# Altium project class-sensor.PrjPcb (part 2 of 2)

## Sheet sensor-4.SchDoc
size Letter
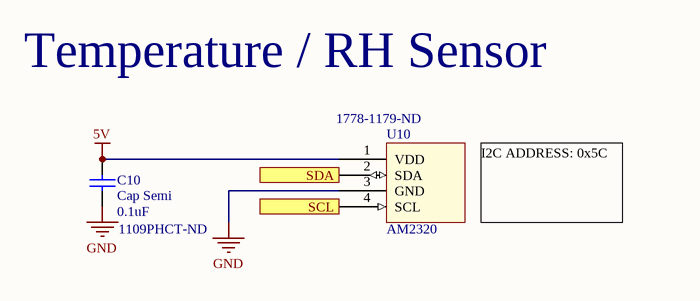
[diagram p3: sensor-4.SchDoc]

### Parts
C10  Cap Semi  value 0.1uF  Supplier Part Number 1: 1109PHCT-ND  [A104K15X7RF5TAA]
U10  AM2320  Supplier Part Number 1: 1778-1179-ND  [AM2320]

### Ports
SCL, SDA

### Nets
5V: C10.2 U10.1(VDD)
GND: C10.1 U10.3(GND)
NetR3_1: U10.4(SCL) ; port SCL
NetR4_1: U10.2(SDA) ; port SDA

### Notes on the sheet
- Temperature / RH Sensor
- I2C ADDRESS: 0x5C

### Library data of the parts
C10 = Cap Semi: Capacitor (Semiconductor SIM Model); Manufacturer: Vishay BCcomponents; Capacitance: 100nF; Voltage Rating: 50V; Tolerance: 10%; Dielectric: X7R; Lead Length: 24.3mm; Lead Diameter: 0.5mm; Published: 8-Jun-2000; LatestRevisionDate: 29-May-2009; LatestRevisionNote: IPC-7351 Footprint Added.; PackageReference: C1206; Publisher: Altium Limited; PackageDescription: Chip Capacitor; Supplier 1: Digi-Key; Manufacturer Part Number: A104K15X7RF5TAA; Stock 1: 502711; Pricing 1: 1=0.24000, 10=0.16500, 100=0.09350, 500=0.06598, 1000=0.05773, 2500=0.05498 (USD); RoHS: Yes; Mount: Through Hole,PCB,Axial; Case/Package: Dipped; Contact Plating: Tin; Min Operating Temperature: -55°C; Max Operating Temperature: 125°C; Package Quantity: 1; Packaging: Tape and Reel; Voltage Rating (DC): 50V; Termination: Axial; Voltage: 50V; Diameter: 2.5mm; Length: 3.8mm; Radiation Hardening: No; REACH SVHC: Unknown; Lead Free: Lead Free; ComponentLink1URL: https://datasheet.ciiva.com/145/aseries-145936.pdf?src-supplier=Digi-Key; ComponentLink1Description: https://datasheet.ciiva.com/145/aseries-145936.pdf?src-supplier=Digi-Key; ComponentLink2URL: https://datasheet.ciiva.com/5815/1734588-5815375.pdf?src-supplier=Farnell; ComponentLink2Description: https://datasheet.ciiva.com/5815/1734588-5815375.pdf?src-supplier=Farnell; ComponentLink3URL: https://datasheet.ciiva.com/18442/70122957-18442089.pdf?src-supplier=Allied+Electronics; ComponentLink3Description: https://datasheet.ciiva.com/18442/70122957-18442089.pdf?src-supplier=Allied+Electronics; ComponentLink4URL: https://datasheet.ciiva.com/2988/aseries-2988250.pdf?src-supplier=Avnet; ComponentLink4Description: https://datasheet.ciiva.com/2988/aseries-2988250.pdf?src-supplier=Avnet; ComponentLink5URL: https://datasheet.ciiva.com/17444/aseries-17444908.pdf?src-supplier=Avnet+Europe; ComponentLink5Description: https://datasheet.ciiva.com/17444/aseries-17444908.pdf?src-supplier=Avnet+Europe; ComponentLink6URL: https://datasheet.ciiva.com/46418/1796772-46418252.pdf?src-supplier=Element14; ComponentLink6Description: https://datasheet.ciiva.com/46418/1796772-46418252.pdf?src-supplier=Element14; ComponentLink7URL: https://datasheet.ciiva.com/145/aseries-145935.pdf?src-supplier=Digi-Key; ComponentLink7Description: https://datasheet.ciiva.com/145/aseries-145935.pdf?src-supplier=Digi-Key
U10 = AM2320: Humidity Temperature Sensor 10 ~ 99% RH I²C ±3% RH 5s Through Hole; Manufacturer: Pimoroni; Manufacturer Part Number: COM1700; Supplier 1: Digi-Key; Stock 1: 149; Pricing 1: 1=3.76000 (USD); RoHS: No

## Sheet sensor-5.SchDoc
size Letter
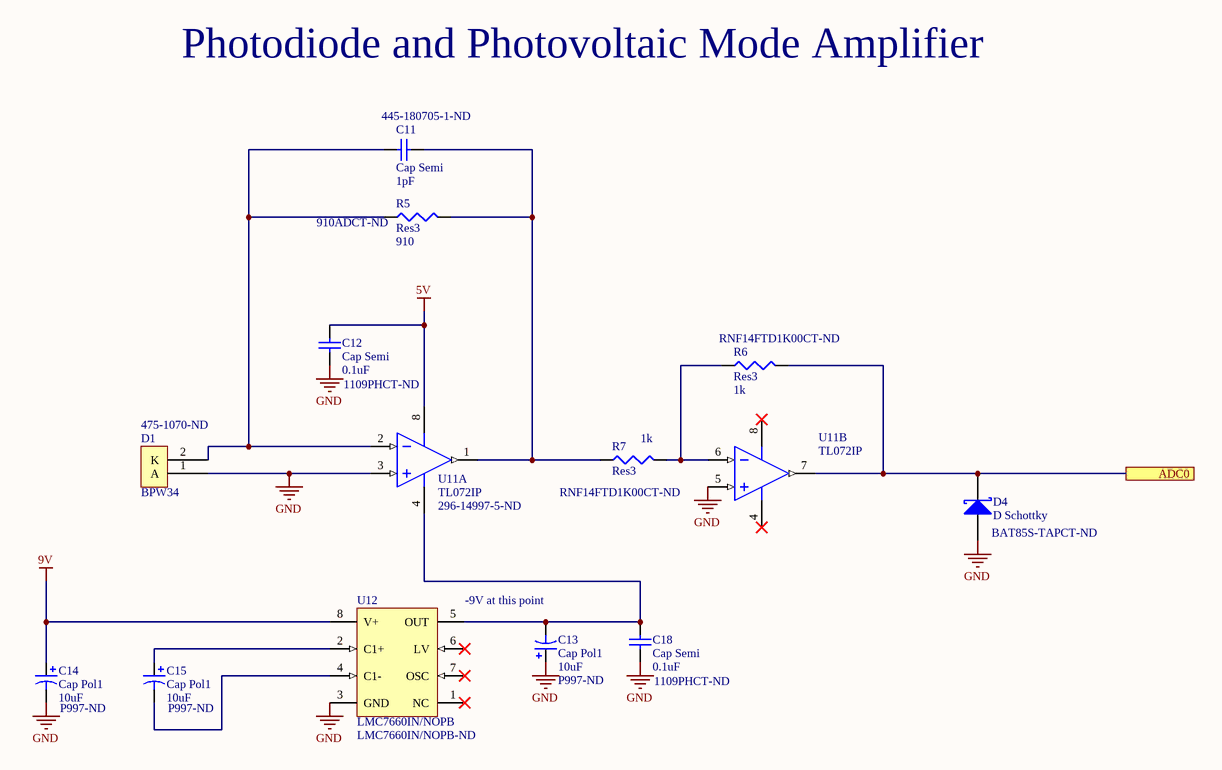
[diagram p4: sensor-5.SchDoc]

### Parts
C11  Cap Semi  value 1pF  Supplier Part Number 1: 445-180705-1-ND  [FA28C0G1H010CNU06]
C12  Cap Semi  value 0.1uF  Supplier Part Number 1: 1109PHCT-ND  [A104K15X7RF5TAA]
C13  Cap Pol1  value 10uF  Supplier Part Number 1: P997-ND  [ECE-A1HKS100]
C14  Cap Pol1  value 10uF  Supplier Part Number 1: P997-ND  [ECE-A1HKS100]
C15  Cap Pol1  value 10uF  Supplier Part Number 1: P997-ND  [ECE-A1HKS100]
C18  Cap Semi  value 0.1uF  Supplier Part Number 1: 1109PHCT-ND  [A104K15X7RF5TAA]
D1  BPW34  Supplier Part Number 1: 475-1070-ND  [BPW34]
D4  D Schottky  Supplier Part Number 1: BAT85S-TAPCT-ND  [BAT85S-TAP]
R5  Res3  value 910  Supplier Part Number 1: 910ADCT-ND  [MFP-25BRD52-910R]
R6  Res3  value 1k  Supplier Part Number 1: RNF14FTD1K00CT-ND  [RNF14FTD1K00]
R7  Res3  value 1k  Supplier Part Number 1: RNF14FTD1K00CT-ND  [RNF14FTD1K00]
U11  TL072IP  Supplier Part Number 1: 296-14997-5-ND  [P0008A]  (parts A,B of 2)
U12  LMC7660IN/NOPB  Supplier Part Number 1: LMC7660IN/NOPB-ND  [P0008A]

### Ports
ADC0

### Nets
5V: C12.2 U11.8(VCC+)
9V: C14.1 U12.8(V+)
GND: C12.1 C13.1 C14.2 C18.1 D1.1(A) D4.1(A) U11.3(IN1+) U11.5(IN2+) U12.3(GND)
NetC11_1: C11.1 D1.2(K) R5.1 U11.2(IN1-)
NetC11_2: C11.2 R5.2 R7.1 U11.1(OUT1)
NetC13_2: C13.2 C18.2 U11.4(VCC-) U12.5(OUT)
NetC15_1: C15.1 U12.2(C1+)
NetC15_2: C15.2 U12.4(C1-)
NetD4_2: D4.2(K) R6.2 U11.7(OUT2) ; port ADC0
NetR6_1: R6.1 R7.2 U11.6(IN2-)

Not connected (* = marked no-connect by the designer): U12 1(NC)* 6(LV)* 7(OSC)*

### Notes on the sheet
- Photodiode and Photovoltaic Mode Amplifier
- -9V at this point

### Library data of the parts
C11 = Cap Semi: Capacitor (Semiconductor SIM Model); Manufacturer: TDK; Voltage Rating: 50V; Lead/Base Style: Kinked; Published: 8-Jun-2000; LatestRevisionDate: 29-May-2009; LatestRevisionNote: IPC-7351 Footprint Added.; PackageReference: C1206; Publisher: Altium Limited; PackageDescription: Chip Capacitor; Supplier 1: Digi-Key; Manufacturer Part Number: FA28C0G1H010CNU06; Stock 1: 7819; Pricing 1: 1=0.32000, 10=0.22100, 100=0.12520, 500=0.08840, 1000=0.07735 (USD); Mount: Through Hole; Case/Package: Radial; Min Operating Temperature: -55°C; Max Operating Temperature: 125°C; Packaging: Tape and Reel; Capacitance: 1pF; Length: 0.157inch; Width: 0.098inch; Height - Seated (Max): 0.217inch; Lead Pitch: 0.197inch; Ratings: AEC-Q200; ComponentLink1URL: https://product.tdk.com/info/en/catalog/datasheets/leadmlcc_halogenfree_fa_en.pdf?src-supplier=Digi-Key; ComponentLink1Description: https://product.tdk.com/info/en/catalog/datasheets/leadmlcc_halogenfree_fa_en.pdf?src-supplier=Digi-Key
C12 C18 = Cap Semi: as C10 on sheet sensor-4; Published: 8-Jun-2000; LatestRevisionDate: 29-May-2009; LatestRevisionNote: IPC-7351 Footprint Added.; PackageReference: C1206; Publisher: Altium Limited; PackageDescription: Chip Capacitor; Supplier 1: Digi-Key; Manufacturer Part Number: A104K15X7RF5TAA; Stock 1: 502711; Pricing 1: 1=0.24000, 10=0.16500, 100=0.09350, 500=0.06598, 1000=0.05773, 2500=0.05498 (USD); RoHS: Yes; Mount: Through Hole,PCB,Axial; Case/Package: Dipped; Contact Plating: Tin; Min Operating Temperature: -55°C; Max Operating Temperature: 125°C; Package Quantity: 1; Packaging: Tape and Reel; Voltage Rating (DC): 50V; Termination: Axial; Voltage: 50V; Diameter: 2.5mm; Length: 3.8mm; Radiation Hardening: No; REACH SVHC: Unknown; Lead Free: Lead Free; ComponentLink1URL: https://datasheet.ciiva.com/145/aseries-145936.pdf?src-supplier=Digi-Key; ComponentLink1Description: https://datasheet.ciiva.com/145/aseries-145936.pdf?src-supplier=Digi-Key; ComponentLink2URL: https://datasheet.ciiva.com/5815/1734588-5815375.pdf?src-supplier=Farnell; ComponentLink2Description: https://datasheet.ciiva.com/5815/1734588-5815375.pdf?src-supplier=Farnell; ComponentLink3URL: https://datasheet.ciiva.com/18442/70122957-18442089.pdf?src-supplier=Allied+Electronics; ComponentLink3Description: https://datasheet.ciiva.com/18442/70122957-18442089.pdf?src-supplier=Allied+Electronics; ComponentLink4URL: https://datasheet.ciiva.com/2988/aseries-2988250.pdf?src-supplier=Avnet; ComponentLink4Description: https://datasheet.ciiva.com/2988/aseries-2988250.pdf?src-supplier=Avnet; ComponentLink5URL: https://datasheet.ciiva.com/17444/aseries-17444908.pdf?src-supplier=Avnet+Europe; ComponentLink5Description: https://datasheet.ciiva.com/17444/aseries-17444908.pdf?src-supplier=Avnet+Europe; ComponentLink6URL: https://datasheet.ciiva.com/46418/1796772-46418252.pdf?src-supplier=Element14; ComponentLink6Description: https://datasheet.ciiva.com/46418/1796772-46418252.pdf?src-supplier=Element14; ComponentLink7URL: https://datasheet.ciiva.com/145/aseries-145935.pdf?src-supplier=Digi-Key; ComponentLink7Description: https://datasheet.ciiva.com/145/aseries-145935.pdf?src-supplier=Digi-Key
C13-C15 = Cap Pol1: Polarized Capacitor (Radial); Manufacturer: Panasonic; Ripple Current: 35mA; Tolerance: 20%; Voltage Rating: 50V; Polarity: Polar; Life (Hours): 1000Hour; Leakage Current: 3A; Lead Diameter: 0.45mm; Published: 8-Jun-2000; LatestRevisionDate: 17-Jul-2002; LatestRevisionNote: Re-released for DXP Platform.; PackageReference: RB7.6-15; Publisher: Altium Limited; PackageDescription: Polarized Capacitor (Radial); 2 Leads; Supplier 1: Digi-Key; Manufacturer Part Number: ECE-A1HKS100; Stock 1: 132836; Pricing 1: 1=0.10000, 10=0.03000 (USD); RoHS: Yes; Mount: Through Hole,PCB; Case/Package: Radial; Number of Pins: 2; Weight: 0.01lb; Min Operating Temperature: -40°C; Max Operating Temperature: 85°C; Package Quantity: 200; Capacitance: 10uF; Packaging: Bulk; Voltage Rating (DC): 50V; Ripple Current (AC): 35mA; Termination: Radial; Voltage: 50V; Diameter: 6.3mm; Length: 5mm; Height: 5mm; Lead Pitch: 2.5mm; Width: 0.5inch; Height - Seated (Max): 0.197inch; Radiation Hardening: No; Lead Free: Lead Free; REACH SVHC: No SVHC; ComponentLink1URL: https://datasheet.ciiva.com/11778/0900766b800274c4-11778985.pdf?src-supplier=RSComponents; ComponentLink1Description: https://datasheet.ciiva.com/11778/0900766b800274c4-11778985.pdf?src-supplier=RSComponents; ComponentLink2URL: https://datasheet.ciiva.com/17536/aba0000ce15-17536597.pdf?src-supplier=Avnet+Europe; ComponentLink2Description: https://datasheet.ciiva.com/17536/aba0000ce15-17536597.pdf?src-supplier=Avnet+Europe; ComponentLink3URL: https://datasheet.ciiva.com/14594/70067878-14594328.pdf?src-supplier=Allied+Electronics; ComponentLink3Description: https://datasheet.ciiva.com/14594/70067878-14594328.pdf?src-supplier=Allied+Electronics; ComponentLink4URL: https://datasheet.ciiva.com/16205/aba0000ce15-16205737.pdf?src-supplier=Future+Electronics; ComponentLink4Description: https://datasheet.ciiva.com/16205/aba0000ce15-16205737.pdf?src-supplier=Future+Electronics; ComponentLink5URL: https://datasheet.ciiva.com/24025/a-e-461514-24025641.pdf?src-supplier=Mouser; ComponentLink5Description: https://datasheet.ciiva.com/24025/a-e-461514-24025641.pdf?src-supplier=Mouser; ComponentLink6URL: https://datasheet.ciiva.com/43459/1339471-43459545.pdf?src-supplier=Farnell; ComponentLink6Description: https://datasheet.ciiva.com/43459/1339471-43459545.pdf?src-supplier=Farnell; ComponentLink7URL: https://datasheet.ciiva.com/15166/getdatasheetpartid-169217-15166123.pdf?src-supplier=Verical; ComponentLink7Description: https://datasheet.ciiva.com/15166/getdatasheetpartid-169217-15166123.pdf?src-supplier=Verical; ComponentLink8URL: https://datasheet.ciiva.com/46397/1339471-46397117.pdf?src-supplier=Element14; ComponentLink8Description: https://datasheet.ciiva.com/46397/1339471-46397117.pdf?src-supplier=Element14; ComponentLink9URL: https://datasheet.ciiva.com/2983/aba0000ce15-2983886.pdf?src-supplier=Avnet; ComponentLink9Description: https://datasheet.ciiva.com/2983/aba0000ce15-2983886.pdf?src-supplier=Avnet
D1 = BPW34: Manufacturer: Osram Opto; Reverse Breakdown Voltage: 32V; Forward Voltage: 1.3V; Rise Time: 20ns; Wavelength: 850nm; Polarity: Reverse; Power Dissipation: 150mW; Dark Current: 30nA; Supplier 1: Digi-Key; Manufacturer Part Number: BPW34; Stock 1: 40998; Pricing 1: 1=1.05000, 10=0.81700, 100=0.52550, 500=0.44374, 1000=0.35033, 2500=0.32697, 5000=0.31529, 10000=0.31062, 25000=0.30362 (USD); RoHS: Yes; Mount: Through Hole; Number of Pins: 2; Min Operating Temperature: -40°C; Max Operating Temperature: 100°C; Packaging: Bulk; Fall Time: 20ns; Radiation Hardening: No; ComponentLink1URL: https://datasheet.ciiva.com/19453/1621132-19453495.pdf?src-supplier=Jameco; ComponentLink1Description: https://datasheet.ciiva.com/19453/1621132-19453495.pdf?src-supplier=Jameco; ComponentLink2URL: https://datasheet.ciiva.com/11772/0900766b80a15a67-11772491.pdf?src-supplier=RSComponents; ComponentLink2Description: https://datasheet.ciiva.com/11772/0900766b80a15a67-11772491.pdf?src-supplier=RSComponents; ComponentLink3URL: https://datasheet.ciiva.com/26883/getdatasheetpartid-571168-26883163.pdf?src-supplier=Verical; ComponentLink3Description: https://datasheet.ciiva.com/26883/getdatasheetpartid-571168-26883163.pdf?src-supplier=Verical; ComponentLink4URL: https://datasheet.ciiva.com/29138/153005-da-01-ml-pin-photodiode-bpw34-osr-de-en-29138768.pdf?src-supplier=Conrad; ComponentLink4Description: https://datasheet.ciiva.com/29138/153005-da-01-ml-pin-photodiode-bpw34-osr-de-en-29138768.pdf?src-supplier=Conrad
D4 = D Schottky: Schottky Diode; Manufacturer: Vishay; Forward Current: 200mA; Peak Reverse Current: 2uA; Reverse Recovery Time: 5ns; Peak Non-Repetitive Surge Current: 5A; Max Repetitive Reverse Voltage (Vrrm): 30V; Element Configuration: Single; Forward Voltage: 800mV; Published: 8-Jun-2000; LatestRevisionDate: 17-Jul-2002; LatestRevisionNote: Re-released for DXP Platform.; PackageReference: SMB; Publisher: Altium Limited; PackageDescription: DO-214-AA/SMB; 2 C-Bend Leads; Body 5.3 x 3.6 mm, inc. leads (LxW); Code_JEDEC: DO-214-AA; Supplier 1: Digi-Key; Manufacturer Part Number: BAT85S-TAP; Stock 1: 54447; Pricing 1: 1=0.38000, 10=0.31000, 100=0.16440, 500=0.10816, 1000=0.07354, 2500=0.06633, 5000=0.05768 (USD); RoHS: Yes; Mount: Through Hole; Number of Pins: 2; Contact Plating: Tin,Silver; Min Operating Temperature: -65°C; Max Operating Temperature: 125°C; Package Quantity: 10000; Packaging: Ammo Pack; Average Rectified Current: 200mA; Max Reverse Voltage (DC): 30V; Max Surge Current: 5A; Recovery Time: 5ns; Max Reverse Leakage Current: 2uA; Max Forward Surge Current (Ifsm): 5A; Length: 3.9mm; Height: 1.7mm; Width: 1.7mm; Radiation Hardening: No; Lead Free: Lead Free; ComponentLink1URL: https://datasheet.ciiva.com/23785/1749004-23785297.pdf?src-supplier=Newark; ComponentLink1Description: https://datasheet.ciiva.com/23785/1749004-23785297.pdf?src-supplier=Newark; ComponentLink2URL: https://datasheet.ciiva.com/17078/bat85s-tap-17078427.pdf?src-supplier=Allied+Electronics; ComponentLink2Description: https://datasheet.ciiva.com/17078/bat85s-tap-17078427.pdf?src-supplier=Allied+Electronics; ComponentLink3URL: https://datasheet.ciiva.com/15144/getdatasheetpartid-50689-15144221.pdf?src-supplier=Verical; ComponentLink3Description: https://datasheet.ciiva.com/15144/getdatasheetpartid-50689-15144221.pdf?src-supplier=Verical; ComponentLink4URL: https://datasheet.ciiva.com/16418/bat85s-16418454.pdf?src-supplier=Future+Electronics; ComponentLink4Description: https://datasheet.ciiva.com/16418/bat85s-16418454.pdf?src-supplier=Future+Electronics; ComponentLink5URL: https://datasheet.ciiva.com/25931/bat85s-25931304.pdf?src-supplier=Avnet+Europe; ComponentLink5Description: https://datasheet.ciiva.com/25931/bat85s-25931304.pdf?src-supplier=Avnet+Europe; ComponentLink6URL: https://datasheet.ciiva.com/13950/bat85s-13950093.pdf?src-supplier=Digi-Key; ComponentLink6Description: https://datasheet.ciiva.com/13950/bat85s-13950093.pdf?src-supplier=Digi-Key; ComponentLink7URL: https://datasheet.ciiva.com/13950/bat85s-13950090.pdf?src-supplier=Digi-Key; ComponentLink7Description: https://datasheet.ciiva.com/13950/bat85s-13950090.pdf?src-supplier=Digi-Key; ComponentLink8URL: https://datasheet.ciiva.com/8283/bat85s-8283915.pdf?src-supplier=Avnet; ComponentLink8Description: https://datasheet.ciiva.com/8283/bat85s-8283915.pdf?src-supplier=Avnet
R5 = Res3: Resistor; Manufacturer: Yageo; Resistance: 910R; Tolerance: 0.1%; Max Power Dissipation: 250mW; Temperature Coefficient: 25ppm/°C; Published: 8-Jun-2000; LatestRevisionDate: 29-May-2009; LatestRevisionNote: IPC-7351 Footprint Added.; PackageReference: J1-0603; Publisher: Altium Limited; PackageDescription: Chip Resistor; Supplier 1: Digi-Key; Manufacturer Part Number: MFP-25BRD52-910R; Stock 1: 18352; Pricing 1: 1=0.63000, 10=0.46700, 25=0.37920, 50=0.32960, 100=0.27190, 250=0.23624, 500=0.19228, 1000=0.15250 (USD); RoHS: Yes; Case/Package: Axial; Min Operating Temperature: -55°C; Max Operating Temperature: 155°C; Package Quantity: 1; Packaging: Tape and Reel; Composition: Metal Film; Number of Terminations: 2; Length: 0.248inch; Lead Free: Lead Free; ComponentLink1URL: https://datasheet.ciiva.com/2713/yageolr-mfp-2013-2713082.pdf?src-supplier=Digi-Key; ComponentLink1Description: https://datasheet.ciiva.com/2713/yageolr-mfp-2013-2713082.pdf?src-supplier=Digi-Key; ComponentLink2URL: https://datasheet.ciiva.com/2713/yageolr-mfp-2013-2713083.pdf?src-supplier=Digi-Key; ComponentLink2Description: https://datasheet.ciiva.com/2713/yageolr-mfp-2013-2713083.pdf?src-supplier=Digi-Key
R6 R7 = Res3: Resistor; Manufacturer: Stackpole Electronics; Resistance: 1kR; Tolerance: 1%; Power Rating: 250mW; Temperature Coefficient: 100ppm/°C; Published: 8-Jun-2000; LatestRevisionDate: 29-May-2009; LatestRevisionNote: IPC-7351 Footprint Added.; PackageReference: J1-0603; Publisher: Altium Limited; PackageDescription: Chip Resistor; Supplier 1: Digi-Key; Manufacturer Part Number: RNF14FTD1K00; Stock 1: 259426; Pricing 1: 1=0.10000, 10=0.07200, 25=0.04960, 50=0.03860, 100=0.02750, 250=0.02144, 500=0.01706, 1000=0.01210 (USD); RoHS: Yes; Mount: Through Hole,Axial; Case/Package: Conformal; Contact Plating: Copper,Tin; Min Operating Temperature: -55°C; Max Operating Temperature: 155°C; Packaging: Tape and Reel; Package Quantity: 1; Composition: Metal Film; Number of Terminations: 2; Termination: Axial; Military Standard: Not; Max Power Dissipation: 250mW; Features: Flame Retardant Coating; Diameter: 2.35mm; Length: 6.35mm; Radiation Hardening: No; Lead Free: Lead Free; ComponentLink1URL: http://components.arrow.com/part/dataview/50573548S9848899N1174?src-supplier=Arrow; ComponentLink1Description: http://components.arrow.com/part/dataview/50573548S9848899N1174?src-supplier=Arrow; ComponentLink2URL: https://www.seielect.com/Catalog/SEI-RNF_RNMF.pdf?src-supplier=Avnet; ComponentLink2Description: https://www.seielect.com/Catalog/SEI-RNF_RNMF.pdf?src-supplier=Avnet; ComponentLink3URL: https://www.seielect.com/Catalog/SEI-RNF_RNMF.pdf?src-supplier=Digi-Key; ComponentLink3Description: https://www.seielect.com/Catalog/SEI-RNF_RNMF.pdf?src-supplier=Digi-Key; ComponentLink4URL: https://www.verical.com/server-webapp/html/getDatasheet?partID=360720&src-supplier=Verical; ComponentLink4Description: https://www.verical.com/server-webapp/html/getDatasheet?partID=360720&src-supplier=Verical; ComponentLink5URL: http://www.seielect.com/Catalog/SEI-RNF_RNMF.pdf?src-supplier=Future+Electronics; ComponentLink5Description: http://www.seielect.com/Catalog/SEI-RNF_RNMF.pdf?src-supplier=Future+Electronics
U11 = CMP-0017-00928-2: Dual Low-Noise JFET-Input General-Purpose Operational Amplifier, 7 to 36 V, -40 to 85 degC, 8-pin DIP (P8), Pb-Free (RoHS); Manufacturer: Texas Instruments; GBW(Typ)(MHz): 3; Total Supply Voltage(Min)(+5V is 5, +/-5V is 10): 7; Slew Rate(Typ)(V/us): 13; Offset Drift(Typ)(uV/C): 18; Total Supply Voltage(Max)(+5V is 5, +/-5V is 10): 36; Rating: Catalog; CMRR(Min)(dB): 75; Number of Channels: 2; Sub Family: General Purpose Amplifier, High Supply Voltage Amplifier (>=30V); Vio (25C)(Max)(mV): 6; IIB(Max)(pA): 200; Iq per channel(Max)(mA): 2.5; Dual Supply Voltage: 9V; Voltage Gain: 106.02dB; Bandwidth: 3MHz; Operating Supply Voltage: 18V; Min Dual Supply Voltage: 3.5V; Nominal Supply Current: 5mA; Common Mode Rejection Ratio: 75dB; Slew Rate: 13V/µs; Max I/O Voltage: 6mV; Input Bias Current: 200pA; Operating Supply Current: 1.4mA; ComponentLink3URL: http://www.ti.com/litv/pdf/mpdi001b; Code_JEDEC: MS-001; Vn at 1kHz(Typ)(nV/rtHz): 18; ComponentLink2URL: http://www.ti.com/lit/ds/symlink/tl072.pdf; DatasheetVersion: SLOS080J; PackageVersion: 4040082/E, 04/2010; PartNumber: TL072IP; Eco-Plan: Pb-Free (RoHS); Mounting Technology: Through Hole; ComponentLink3Description: Package Specification; ComponentLink1Description: Manufacturer URL; PackageReference: P0008A; PackageDescription: 8-Pin Plastic In-Line, Body 9.59 x 6.35 mm, Pitch 2.54 mm; ComponentLink1URL: http://www.ti.com/; ComponentLink2Description: Datasheet; Supplier 1: Digi-Key; Manufacturer Part Number: TL072IP; Stock 1: 1917; Pricing 1: 1=0.69000, 10=0.60700, 25=0.57040, 100=0.46550, 500=0.36800, 1000=0.29440, 2500=0.26680, 5000=0.24840 (USD); RoHS: Yes; Case/Package: P; Number of Pins: 8; Min Operating Temperature: -40°C; Max Operating Temperature: 85°C; Unity Gain Bandwidth Product: 3MHz; Max Dual Supply Voltage: 18V; Packaging: Rail/Tube; Package Quantity: 50; Nominal Gain Bandwidth Product: 3MHz; Number of Circuits: 2; Gain Bandwidth Product: 3MHz; Input Offset Voltage (Vos): 6mV; Number of Amplifiers: 2; Number of Elements: 2; Length: 9.81mm; Height: 4.57mm; Width: 6.35mm; Radiation Hardening: No; REACH SVHC: No SVHC; Lead Free: Lead Free; ComponentLink4URL: https://datasheet.ciiva.com/26847/tl072ip-26847615.pdf?src-supplier=IIIC; ComponentLink4Description: https://datasheet.ciiva.com/26847/tl072ip-26847615.pdf?src-supplier=IIIC; ComponentLink5URL: https://datasheet.ciiva.com/2974/tl074-2974210.pdf?src-supplier=Avnet; ComponentLink5Description: https://datasheet.ciiva.com/2974/tl074-2974210.pdf?src-supplier=Avnet; ComponentLink6URL: https://datasheet.ciiva.com/7738/1847488-7738549.pdf?src-supplier=Element14; ComponentLink6Description: https://datasheet.ciiva.com/7738/1847488-7738549.pdf?src-supplier=Element14; ComponentLink7URL: https://datasheet.ciiva.com/26244/tl074-26244104.pdf?src-supplier=Avnet+Europe; ComponentLink7Description: https://datasheet.ciiva.com/26244/tl074-26244104.pdf?src-supplier=Avnet+Europe; ComponentLink8URL: https://datasheet.ciiva.com/1797/tl071a-1797084.pdf?src-supplier=Digi-Key; ComponentLink8Description: https://datasheet.ciiva.com/1797/tl071a-1797084.pdf?src-supplier=Digi-Key
U12 = CMP-0065-00002-3: Switched Capacitor Voltage Converter, 8-pin MDIP, Pb-Free; Manufacturer: Texas Instruments; PackageTopMarking: NSUZXYTTE#*LMC*7660IN; CompType: Switch Caps; PowerWise: N; Output Voltage: -10V; Min Supply Voltage: 1.5V; Number of Outputs: 1; Frequency: 10kHz; Max Supply Voltage: 10V; Max Output Voltage: -1.5V; Output Power: 1.4W; Quiescent Current: 120uA; Operating Supply Current: 200uA; Logic Function: Inverting; Output Type: Adjustable; Code_JEDEC: MS-001-BA; RoHS: Y; ComponentLink1Description: Datasheet URL; ComponentLink1URL: http://www.ti.com/general/docs/lit/getliterature.tsp?genericPartNumber=LMC7660&fileType=pdf; PinCount: 8; PackageReference: P0008A; PackageDescription: MDIP, .365 x .250 x .130in, 8 Lead, .100in Pitch; Supplier 1: Digi-Key; Manufacturer Part Number: LMC7660IN/NOPB; Stock 1: 2555; Pricing 1: 1=1.29000, 10=1.15100, 25=1.09200, 100=0.89700, 500=0.74100, 1000=0.58500, 2500=0.54600, 5000=0.51870 (USD); Mount: Through Hole; Case/Package: PDIP; Number of Pins: 8; Weight: 0.015521oz; Min Operating Temperature: -40°C; Max Operating Temperature: 85°C; Packaging: Rail/Tube; Min Output Voltage: -10V; Switching Frequency: 10kHz; Min Input Voltage: 1.5V; Max Input Voltage: 10V; Termination: Through Hole; Length: 9.27mm; Height: 3.3mm; Width: 6.35mm; Radiation Hardening: No; REACH SVHC: No SVHC; Lead Free: Lead Free; ComponentLink2URL: https://datasheet.ciiva.com/25627/0900766b80b14545-25627686.pdf?src-supplier=RSComponents; ComponentLink2Description: https://datasheet.ciiva.com/25627/0900766b80b14545-25627686.pdf?src-supplier=RSComponents; ComponentLink3URL: https://datasheet.ciiva.com/41458/001014234-da-01-en-ic-reg-switche-lmc7660in-nopb-pdip-8-tid-41458595.pdf?src-supplier=Conrad; ComponentLink3Description: https://datasheet.ciiva.com/41458/001014234-da-01-en-ic-reg-switche-lmc7660in-nopb-pdip-8-tid-41458595.pdf?src-supplier=Conrad; ComponentLink4URL: https://datasheet.ciiva.com/6598/lmc7660-6598038.pdf?src-supplier=Digi-Key; ComponentLink4Description: https://datasheet.ciiva.com/6598/lmc7660-6598038.pdf?src-supplier=Digi-Key

## Sheet sensor-6.SchDoc
size Letter
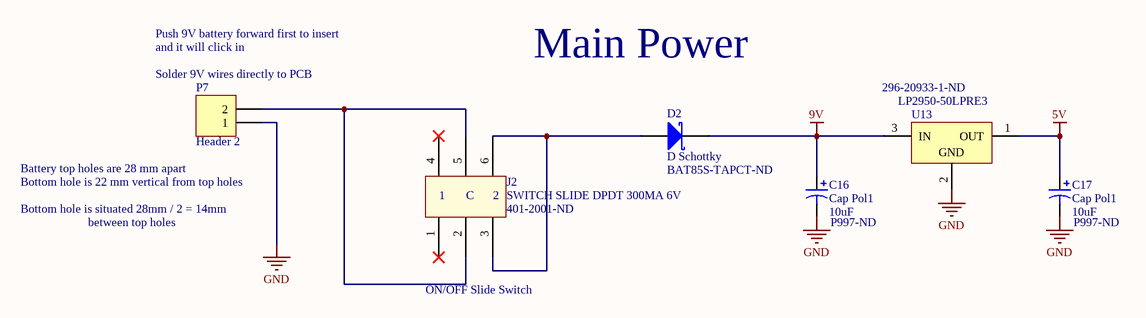
[diagram p5: sensor-6.SchDoc]

### Parts
C16  Cap Pol1  value 10uF  Supplier Part Number 1: P997-ND  [ECE-A1HKS100]
C17  Cap Pol1  value 10uF  Supplier Part Number 1: P997-ND  [ECE-A1HKS100]
D2  D Schottky  Supplier Part Number 1: BAT85S-TAPCT-ND  [BAT85S-TAP]
J2  SWITCH SLIDE DPDT 300MA 6V  Supplier Part Number 1: 401-2001-ND  [JS202011CQN]
P7  Header 2  [HDR1X2]
U13  LP2950-50LPRE3  Supplier Part Number 1: 296-20933-1-ND  [LP0003A]

### Nets
5V: C17.1 U13.1(OUT)
9V: C16.1 D2.2(K) U13.3(IN)
GND: C16.2 C17.2 P7.1 U13.2(GND)
NetD2_1: D2.1(A) J2.3 J2.6
NetJ2_2: J2.2 J2.5 P7.2

Not connected (* = marked no-connect by the designer): J2 1* 4*

### Notes on the sheet
- (near P7) Solder 9V wires directly to PCB
- Push 9V battery forward first to insert
- and it will click in
- Main Power
- (near P7) Battery top holes are 28 mm apart
- Bottom hole is 22 mm vertical from top holes
- Bottom hole is situated 28mm / 2 = 14mm
- between top holes
- ON/OFF Slide Switch
- (in symbol JS202011CQN) C

### Library data of the parts
C16 C17 = Cap Pol1: as C13 on sheet sensor-5; Published: 8-Jun-2000; LatestRevisionDate: 17-Jul-2002; LatestRevisionNote: Re-released for DXP Platform.; PackageReference: RB7.6-15; Publisher: Altium Limited; PackageDescription: Polarized Capacitor (Radial); 2 Leads; Supplier 1: Digi-Key; Manufacturer Part Number: ECE-A1HKS100; Stock 1: 132836; Pricing 1: 1=0.10000, 10=0.03000 (USD); RoHS: Yes; Mount: Through Hole,PCB; Case/Package: Radial; Number of Pins: 2; Weight: 0.01lb; Min Operating Temperature: -40°C; Max Operating Temperature: 85°C; Package Quantity: 200; Capacitance: 10uF; Packaging: Bulk; Voltage Rating (DC): 50V; Ripple Current (AC): 35mA; Termination: Radial; Voltage: 50V; Diameter: 6.3mm; Length: 5mm; Height: 5mm; Lead Pitch: 2.5mm; Width: 0.5inch; Height - Seated (Max): 0.197inch; Radiation Hardening: No; Lead Free: Lead Free; REACH SVHC: No SVHC; ComponentLink1URL: https://datasheet.ciiva.com/11778/0900766b800274c4-11778985.pdf?src-supplier=RSComponents; ComponentLink1Description: https://datasheet.ciiva.com/11778/0900766b800274c4-11778985.pdf?src-supplier=RSComponents; ComponentLink2URL: https://datasheet.ciiva.com/17536/aba0000ce15-17536597.pdf?src-supplier=Avnet+Europe; ComponentLink2Description: https://datasheet.ciiva.com/17536/aba0000ce15-17536597.pdf?src-supplier=Avnet+Europe; ComponentLink3URL: https://datasheet.ciiva.com/14594/70067878-14594328.pdf?src-supplier=Allied+Electronics; ComponentLink3Description: https://datasheet.ciiva.com/14594/70067878-14594328.pdf?src-supplier=Allied+Electronics; ComponentLink4URL: https://datasheet.ciiva.com/16205/aba0000ce15-16205737.pdf?src-supplier=Future+Electronics; ComponentLink4Description: https://datasheet.ciiva.com/16205/aba0000ce15-16205737.pdf?src-supplier=Future+Electronics; ComponentLink5URL: https://datasheet.ciiva.com/24025/a-e-461514-24025641.pdf?src-supplier=Mouser; ComponentLink5Description: https://datasheet.ciiva.com/24025/a-e-461514-24025641.pdf?src-supplier=Mouser; ComponentLink6URL: https://datasheet.ciiva.com/43459/1339471-43459545.pdf?src-supplier=Farnell; ComponentLink6Description: https://datasheet.ciiva.com/43459/1339471-43459545.pdf?src-supplier=Farnell; ComponentLink7URL: https://datasheet.ciiva.com/15166/getdatasheetpartid-169217-15166123.pdf?src-supplier=Verical; ComponentLink7Description: https://datasheet.ciiva.com/15166/getdatasheetpartid-169217-15166123.pdf?src-supplier=Verical; ComponentLink8URL: https://datasheet.ciiva.com/46397/1339471-46397117.pdf?src-supplier=Element14; ComponentLink8Description: https://datasheet.ciiva.com/46397/1339471-46397117.pdf?src-supplier=Element14; ComponentLink9URL: https://datasheet.ciiva.com/2983/aba0000ce15-2983886.pdf?src-supplier=Avnet; ComponentLink9Description: https://datasheet.ciiva.com/2983/aba0000ce15-2983886.pdf?src-supplier=Avnet
D2 = D Schottky: as D4 on sheet sensor-5; Published: 8-Jun-2000; LatestRevisionDate: 17-Jul-2002; LatestRevisionNote: Re-released for DXP Platform.; PackageReference: SMB; Publisher: Altium Limited; PackageDescription: DO-214-AA/SMB; 2 C-Bend Leads; Body 5.3 x 3.6 mm, inc. leads (LxW); Code_JEDEC: DO-214-AA; Supplier 1: Digi-Key; Manufacturer Part Number: BAT85S-TAP; Stock 1: 54447; Pricing 1: 1=0.38000, 10=0.31000, 100=0.16440, 500=0.10816, 1000=0.07354, 2500=0.06633, 5000=0.05768 (USD); RoHS: Yes; Mount: Through Hole; Number of Pins: 2; Contact Plating: Tin,Silver; Min Operating Temperature: -65°C; Max Operating Temperature: 125°C; Package Quantity: 10000; Packaging: Ammo Pack; Average Rectified Current: 200mA; Max Reverse Voltage (DC): 30V; Max Surge Current: 5A; Recovery Time: 5ns; Max Reverse Leakage Current: 2uA; Max Forward Surge Current (Ifsm): 5A; Length: 3.9mm; Height: 1.7mm; Width: 1.7mm; Radiation Hardening: No; Lead Free: Lead Free; ComponentLink1URL: https://datasheet.ciiva.com/23785/1749004-23785297.pdf?src-supplier=Newark; ComponentLink1Description: https://datasheet.ciiva.com/23785/1749004-23785297.pdf?src-supplier=Newark; ComponentLink2URL: https://datasheet.ciiva.com/17078/bat85s-tap-17078427.pdf?src-supplier=Allied+Electronics; ComponentLink2Description: https://datasheet.ciiva.com/17078/bat85s-tap-17078427.pdf?src-supplier=Allied+Electronics; ComponentLink3URL: https://datasheet.ciiva.com/15144/getdatasheetpartid-50689-15144221.pdf?src-supplier=Verical; ComponentLink3Description: https://datasheet.ciiva.com/15144/getdatasheetpartid-50689-15144221.pdf?src-supplier=Verical; ComponentLink4URL: https://datasheet.ciiva.com/16418/bat85s-16418454.pdf?src-supplier=Future+Electronics; ComponentLink4Description: https://datasheet.ciiva.com/16418/bat85s-16418454.pdf?src-supplier=Future+Electronics; ComponentLink5URL: https://datasheet.ciiva.com/25931/bat85s-25931304.pdf?src-supplier=Avnet+Europe; ComponentLink5Description: https://datasheet.ciiva.com/25931/bat85s-25931304.pdf?src-supplier=Avnet+Europe; ComponentLink6URL: https://datasheet.ciiva.com/13950/bat85s-13950093.pdf?src-supplier=Digi-Key; ComponentLink6Description: https://datasheet.ciiva.com/13950/bat85s-13950093.pdf?src-supplier=Digi-Key; ComponentLink7URL: https://datasheet.ciiva.com/13950/bat85s-13950090.pdf?src-supplier=Digi-Key; ComponentLink7Description: https://datasheet.ciiva.com/13950/bat85s-13950090.pdf?src-supplier=Digi-Key; ComponentLink8URL: https://datasheet.ciiva.com/8283/bat85s-8283915.pdf?src-supplier=Avnet; ComponentLink8Description: https://datasheet.ciiva.com/8283/bat85s-8283915.pdf?src-supplier=Avnet
J2 = JS202011CQN: Manufacturer: ITT C&K; Actuator Material: Nylon,Polyamide; Electrical Life: 5000Cycles; Switch Function: On-On; Illumination Type: Non-Illuminated; Contact Current Rating: 100mA; Contact Resistance: 70mR; Switch Travel: 2mm; Actuator Type: Standard; Supplier 1: Digi-Key; Manufacturer Part Number: JS202011CQN; Stock 1: 30365; Pricing 1: 1=0.43000, 10=0.41600, 25=0.40720, 50=0.36380, 100=0.34650, 250=0.33784, 500=0.28586, 1000=0.27720, 5000=0.24255 (USD); RoHS: Yes; Mount: Through Hole; Contact Plating: Silver; Contact Material: Copper Alloy; Housing Material: Nylon; Min Operating Temperature: -40°C; Max Operating Temperature: 85°C; Package Quantity: 1; Packaging: Bulk; Termination: PC Pins; Voltage Rating (DC): 6V; Throw Configuration: DPDT; Current Rating: 300mA; Max Voltage Rating (DC): 6V; Max Current Rating: 300mA; Orientation: Vertical; Length: 9mm; Actuator Length: 2mm; Depth: 3.6mm; Radiation Hardening: No; Lead Free: Lead Free; REACH SVHC: No SVHC; Flammability Rating: UL94 V-0; ComponentLink1URL: https://datasheet.ciiva.com/5280/js-15sept15-5280375.pdf?src-supplier=Mouser; ComponentLink1Description: https://datasheet.ciiva.com/5280/js-15sept15-5280375.pdf?src-supplier=Mouser; ComponentLink2URL: https://datasheet.ciiva.com/22630/1707718-22630695.pdf?src-supplier=Element14; ComponentLink2Description: https://datasheet.ciiva.com/22630/1707718-22630695.pdf?src-supplier=Element14; ComponentLink3URL: https://datasheet.ciiva.com/8082/js-9dec14-8082522.pdf?src-supplier=Avnet; ComponentLink3Description: https://datasheet.ciiva.com/8082/js-9dec14-8082522.pdf?src-supplier=Avnet; ComponentLink4URL: https://datasheet.ciiva.com/2889/js-9dec14-2889166.pdf?src-supplier=Digi-Key; ComponentLink4Description: https://datasheet.ciiva.com/2889/js-9dec14-2889166.pdf?src-supplier=Digi-Key
P7 = Header 2: Header, 2-Pin; LatestRevisionDate: 17-Jul-2002; LatestRevisionNote: Re-released for DXP Platform.; Publisher: Altium Limited
U13 = CMP-0758-00015-2: Single Output LDO, 100 mA, Fixed 5 V Output, 5.4 to 30 V Input, 3-Pin TO-92 (LP), RoHS, Tape and Reel; Manufacturer: Texas Instruments; Output Capacitor Type: Non-Ceramic; Rating: Catalog; Vout (Min) (V): 4.95; Fixed Output Options (V): 5; Output Options: Fixed Output; Accuracy (%): 1.4; Vin (Max) (V): 30; Vin (Min) (V): 5.4; Vdo (Typ) (mV): 380; Vout (Max) (V): 5.05; Iq (Typ) (mA): 0.075; Iout (Max) (A): 0.1; Dropout Voltage: 380mV; Output Current: 100mA; Number of Outputs: 1; Output Voltage: 5V; Min Supply Voltage: 2V; Max Input Voltage: 30V; Min Input Voltage: 5.4V; Input Bias Current: 75uA; Polarity: Positive; Min Output Voltage: 4.95V; Accuracy: 1.4%; Max Output Voltage: 5.05V; PackageDescription: 3-Pin Plastic Cylindrical Package, Body Dia 4.825 mm, Pitch 2.65 mm; PartNumber: LP2950-50LPRE3; RoHS: TRUE; ComponentLink3Description: Package Specification; DatasheetVersion: SLVS582H; ComponentLink2Description: Datasheet; ComponentLink3URL: http://www.ti.com/lit/ml/msot002c/msot002c.pdf; ComponentLink1Description: Manufacturer URL; ComponentLink1URL: http://www.ti.com/; ComponentLink2URL: http://www.ti.com/lit/ds/symlink/lp2950-30.pdf; Packing: Tape and Reel; PackageVersion: 4040001-2/E; Mounting Technology: Through Hole; PackageReference: LP0003A; Supplier 1: Digi-Key; Manufacturer Part Number: LP2950-50LPRE3; Stock 1: 99647; Pricing 1: 1=0.47000, 10=0.40200, 100=0.29990, 500=0.23566, 1000=0.18210 (USD); Case/Package: TO-92; Number of Pins: 3; Contact Plating: Tin,Matte; Min Operating Temperature: -40°C; Max Operating Temperature: 125°C; Package Quantity: 1; Nominal Output Voltage: 5V; Max Output Current: 100mA; Packaging: Tape and Reel; Number of Regulators: 1; Quiescent Current: 75uA; Termination: Through Hole; Output Voltage Accuracy: 1.4%; Output Type: Fixed; Length: 4.83mm; Height: 3.68mm; Width: 3.43mm; Radiation Hardening: No; REACH SVHC: No SVHC; Lead Free: Lead Free; ComponentLink4URL: https://datasheet.ciiva.com/2041/lp2951-2041968.pdf?src-supplier=Digi-Key; ComponentLink4Description: https://datasheet.ciiva.com/2041/lp2951-2041968.pdf?src-supplier=Digi-Key; ComponentLink5URL: https://datasheet.ciiva.com/3223/lp2951-33-3223814.pdf?src-supplier=Avnet; ComponentLink5Description: https://datasheet.ciiva.com/3223/lp2951-33-3223814.pdf?src-supplier=Avnet; ComponentLink6URL: https://datasheet.ciiva.com/1511/1864445-1511850.pdf?src-supplier=Element14; ComponentLink6Description: https://datasheet.ciiva.com/1511/1864445-1511850.pdf?src-supplier=Element14; ComponentLink7URL: https://datasheet.ciiva.com/46448/1445037-46448763.pdf?src-supplier=Element14; ComponentLink7Description: https://datasheet.ciiva.com/46448/1445037-46448763.pdf?src-supplier=Element14; ComponentLink8URL: https://datasheet.ciiva.com/2041/lp2951-2041966.pdf?src-supplier=Digi-Key; ComponentLink8Description: https://datasheet.ciiva.com/2041/lp2951-2041966.pdf?src-supplier=Digi-Key; ComponentLink9URL: https://datasheet.ciiva.com/2041/lp2951-2041967.pdf?src-supplier=Digi-Key; ComponentLink9Description: https://datasheet.ciiva.com/2041/lp2951-2041967.pdf?src-supplier=Digi-Key

## Nets that join several sheets
5V: sensor-1 (C1.1 C2.2 U1.2), sensor-2 (15 pins), sensor-4 (C10.2 U10.1), sensor-5 (C12.2 U11.8), sensor-6 (C17.1 U13.1)
9V: sensor-5 (C14.1 U12.8), sensor-6 (C16.1 D2.2 U13.3)
GND: sensor-1 (C1.2 C2.1 R1.3 U1.1), sensor-2 (23 pins), sensor-3 (40 pins), sensor-4 (C10.1 U10.3), sensor-5 (9 pins), sensor-6 (C16.2 C17.2 P7.1 U13.2)
NetD4_2: sensor-2 (U6.23), sensor-5 (D4.2 R6.2 U11.7)
NetP4_1: sensor-2 (U8.21), sensor-3 (P4.1)
NetP4_3: sensor-2 (U8.22), sensor-3 (P4.3)
NetP4_5: sensor-2 (U8.23), sensor-3 (P4.5)
NetP4_7: sensor-2 (U8.24), sensor-3 (P4.7)
NetP4_9: sensor-2 (U8.25), sensor-3 (P4.9)
NetP4_11: sensor-2 (U8.26), sensor-3 (P4.11)
NetP4_13: sensor-2 (U8.27), sensor-3 (P4.13)
NetP4_15: sensor-2 (U8.28), sensor-3 (P4.15)
NetP4_17: sensor-2 (U8.8), sensor-3 (P4.17)
NetP4_19: sensor-2 (U8.7), sensor-3 (P4.19)
NetP4_21: sensor-2 (U8.6), sensor-3 (P4.21)
NetP4_23: sensor-2 (U8.5), sensor-3 (P4.23)
NetP4_25: sensor-2 (U8.4), sensor-3 (P4.25)
NetP4_27: sensor-2 (U8.3), sensor-3 (P4.27)
NetP4_29: sensor-2 (U8.2), sensor-3 (P4.29)
NetP4_31: sensor-2 (U8.1), sensor-3 (P4.31)
NetP5_1: sensor-2 (U7.10), sensor-3 (P5.1)
NetP5_3: sensor-2 (U7.11), sensor-3 (P5.3)
NetP5_5: sensor-2 (U7.12), sensor-3 (P5.5)
NetP5_7: sensor-2 (U7.13), sensor-3 (P5.7)
NetP5_9: sensor-2 (U7.14), sensor-3 (P5.9)
NetP5_11: sensor-2 (U7.15), sensor-3 (P5.11)
NetP5_13: sensor-2 (U7.16), sensor-3 (P5.13)
NetP5_15: sensor-2 (U7.17), sensor-3 (P5.15)
NetP6_1: sensor-2 (U9.21), sensor-3 (P6.1)
NetP6_3: sensor-2 (U9.22), sensor-3 (P6.3)
NetP6_5: sensor-2 (U9.23), sensor-3 (P6.5)
NetP6_7: sensor-2 (U9.24), sensor-3 (P6.7)
NetP6_9: sensor-2 (U9.25), sensor-3 (P6.9)
NetP6_11: sensor-2 (U9.26), sensor-3 (P6.11)
NetP6_13: sensor-2 (U9.27), sensor-3 (P6.13)
NetP6_15: sensor-2 (U9.28), sensor-3 (P6.15)
NetP6_17: sensor-2 (U9.8), sensor-3 (P6.17)
NetP6_19: sensor-2 (U9.7), sensor-3 (P6.19)
NetP6_21: sensor-2 (U9.6), sensor-3 (P6.21)
NetP6_23: sensor-2 (U9.5), sensor-3 (P6.23)
NetP6_25: sensor-2 (U9.4), sensor-3 (P6.25)
NetP6_27: sensor-2 (U9.3), sensor-3 (P6.27)
NetP6_29: sensor-2 (U9.2), sensor-3 (P6.29)
NetP6_31: sensor-2 (U9.1), sensor-3 (P6.31)
NetR3_1: sensor-2 (5 pins), sensor-4 (U10.4)
NetR4_1: sensor-2 (5 pins), sensor-4 (U10.2)
NetU1_4: sensor-1 (U1.4), sensor-2 (U6.24)
NetU1_5: sensor-1 (U1.5), sensor-2 (U6.25)
NetU1_6: sensor-1 (U1.6), sensor-2 (U6.26)
NetU1_7: sensor-1 (U1.7), sensor-2 (U6.4)
NetU1_8: sensor-1 (U1.8), sensor-2 (U6.5)
NetU1_9: sensor-1 (U1.9), sensor-2 (U6.6)
NetU1_10: sensor-1 (U1.10), sensor-2 (U6.11)
NetU1_11: sensor-1 (U1.11), sensor-2 (U6.12)
NetU1_12: sensor-1 (U1.12), sensor-2 (U6.13)
NetU1_13: sensor-1 (U1.13), sensor-2 (U6.14)
NetU1_14: sensor-1 (U1.14), sensor-2 (U6.15)